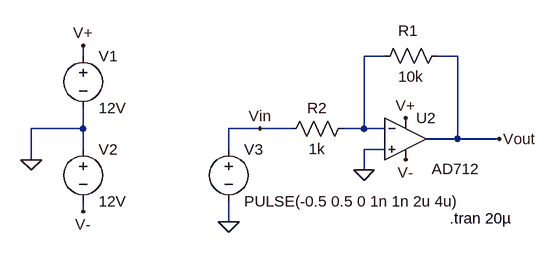
[diagram p0: schematic Inv_OpAmp.asc]
Inv_OpAmp.asc, the LTspice schematic file:
Version 4
SHEET 1 880 680
WIRE -256 80 -256 64
WIRE 208 80 176 80
WIRE 320 80 288 80
WIRE -256 192 -256 160
WIRE -256 192 -336 192
WIRE 16 192 -32 192
WIRE 64 192 16 192
WIRE 176 192 176 80
WIRE 176 192 144 192
WIRE 208 192 176 192
WIRE 320 208 320 80
WIRE 320 208 272 208
WIRE 384 208 320 208
WIRE -256 224 -256 192
WIRE -32 224 -32 192
WIRE 208 224 176 224
WIRE -336 240 -336 192
WIRE 176 256 176 224
WIRE -256 320 -256 304
WIRE -32 336 -32 304
FLAG 240 176 V+
FLAG 240 240 V-
FLAG 176 256 0
FLAG 384 208 Vout
FLAG -336 240 0
FLAG -256 64 V+
FLAG -256 320 V-
FLAG -32 336 0
FLAG 16 192 Vin
SYMBOL res 304 64 R90
WINDOW 0 -7 60 VBottom 2
WINDOW 3 32 56 VTop 2
SYMATTR InstName R1
SYMATTR Value 10k
SYMBOL res 160 176 R90
WINDOW 0 0 56 VBottom 2
WINDOW 3 32 56 VTop 2
SYMATTR InstName R2
SYMATTR Value 1k
SYMBOL voltage -256 64 R0
WINDOW 123 0 0 Left 0
WINDOW 39 0 0 Left 0
SYMATTR InstName V1
SYMATTR Value 12V
SYMBOL voltage -256 208 R0
WINDOW 123 0 0 Left 0
WINDOW 39 0 0 Left 0
SYMATTR InstName V2
SYMATTR Value 12V
SYMBOL voltage -32 208 R0
WINDOW 123 24 124 Left 2
WINDOW 39 0 0 Left 0
SYMATTR InstName V3
SYMATTR Value PULSE(-0.5 0.5 0 1n 1n 2u 4u)
SYMBOL Opamps\\AD712 240 144 R0
WINDOW 3 40 110 Left 2
SYMATTR InstName U2
TEXT 308 330 Left 2 !.tran 20µ

The netlist it stands for:
* Inv_OpAmp.asc
R1 Vout N001 10k
R2 N001 Vin 1k
V1 V+ 0 12V
V2 0 V- 12V
V3 Vin 0 PULSE(-0.5 0.5 0 1n 1n 2u 4u)
XU2 0 N001 V+ V- Vout AD712  ; pins In+ In- V+ V- OUT
.tran 20µ
.backanno
.end